# EAGLE design waterduck (EAGLE 6.5.0)
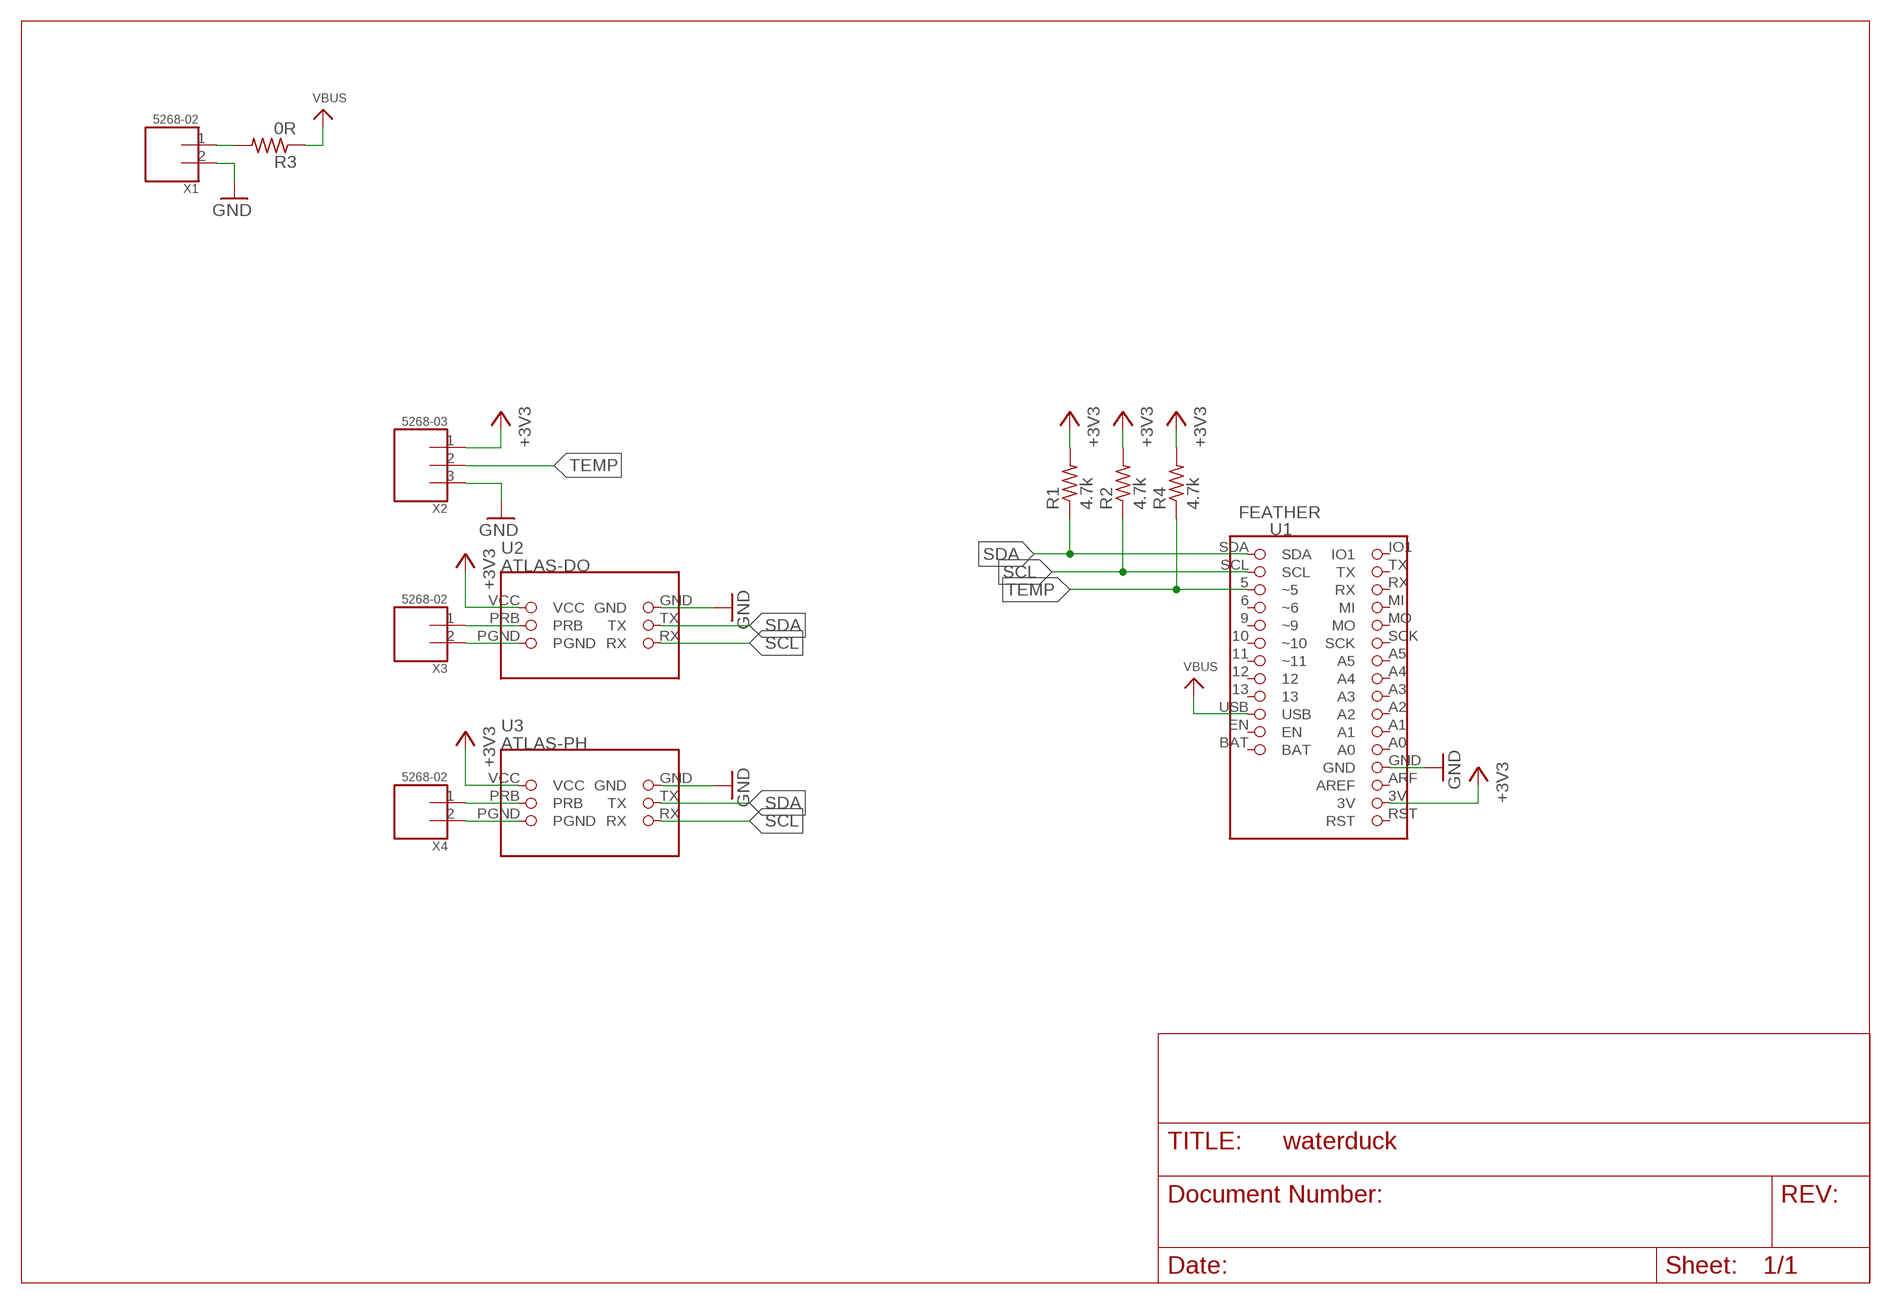
[diagram p0: schematic, sheet 1]

## Parts
R1  4.7k  R0603(1608)  [R0603(1608)]
R2  4.7k  R0603(1608)  [R0603(1608)]
R3  0R  R0603(1608)  [R0603(1608)]
R4  4.7k  R0603(1608)  [R0603(1608)]
U1  FEATHER  [FEATHER]
U2  ATLAS-DO  [ATLAS]
U3  ATLAS-PH  [ATLAS]
X1  5268-02  [5628-02]
X2  5268-03  [5268-03]
X3  5268-02  [5628-02]
X4  5268-02  [5628-02]

## Nets
+3V3: R1.2 R2.2 R4.2 U1.3V U2.VCC U3.VCC X2.1
GND: U1.GND U2.GND U3.GND X1.2 X2.3
N$1: U2.PRB X3.1
N$2: U2.PGND X3.2
N$3: U3.PRB X4.1
N$4: U3.PGND X4.2
N$5: R3.2 X1.1
SCL: R2.1 U1.SCL U2.RX U3.RX
SDA: R1.1 U1.SDA U2.TX U3.TX
TEMP: R4.1 U1.5(~5) X2.2
VBUS: R3.1 U1.USB
Unconnected: U1.6(~6) U1.9(~9) U1.10(~10) U1.11(~11) U1.12 U1.13 U1.A0 U1.A1 U1.A2 U1.A3 U1.A4 U1.A5 U1.ARF(AREF) U1.BAT U1.EN U1.IO1 U1.MI U1.MO U1.RST U1.RX U1.SCK U1.TX

## Library data of the parts
R1-R4 = waterduck:R
U1 = waterduck:FEATHER
U2 U3 = waterduck:ATLAS
X1 X3 X4 = waterduck:5268-02
X2 = waterduck:5268-03

## Board
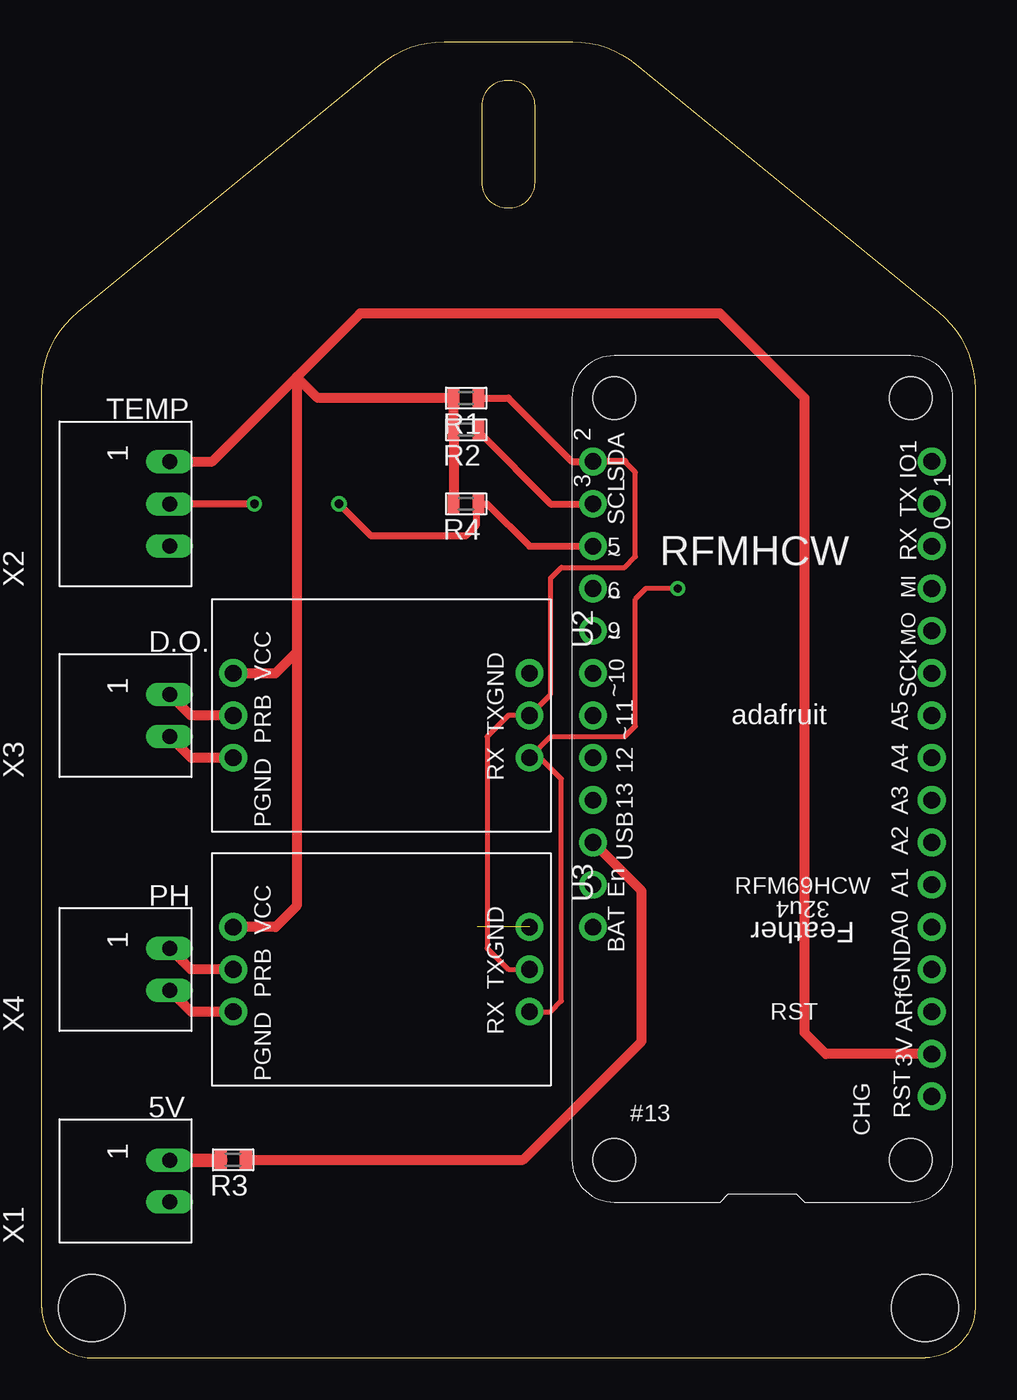
[diagram p1: board, top side]
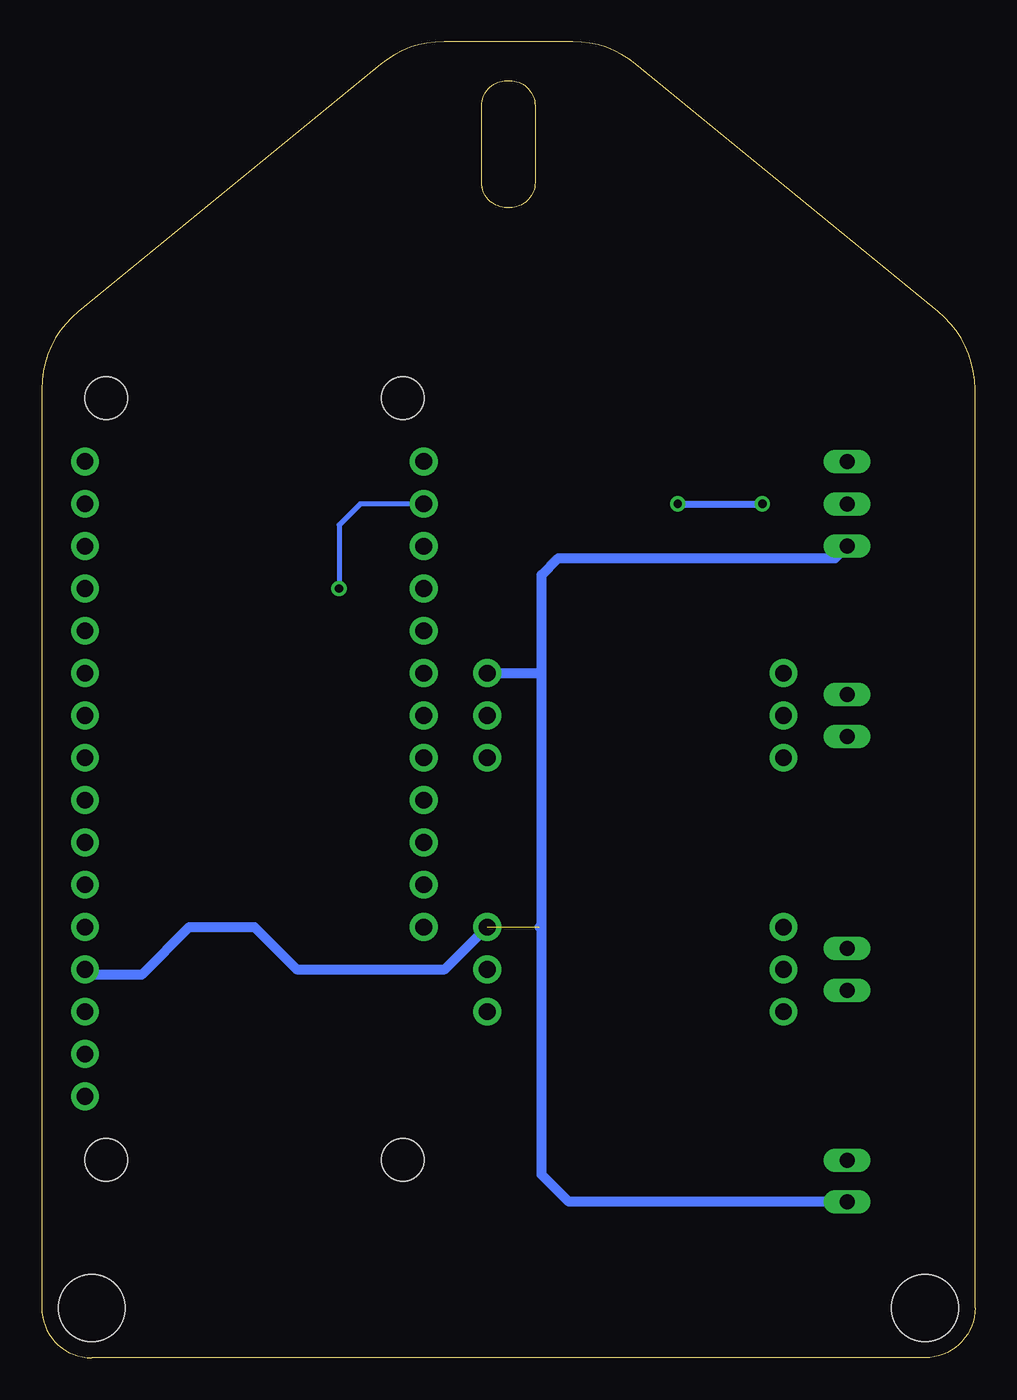
[diagram p2: board, bottom side, seen from below]

Size 56 x 79 mm. Coordinates in mm from the lower left corner, seen from the top.
Outline: 2.2,62.8 20.34,77.64 arc-39 24.14,79 31.86,79 arc-39 35.66,77.64 53.8,62.8 arc-51 56,58.16 56,3 arc-90 53,0 3,0 arc-90 0,3 0,58.16 arc-51 2.2,62.8
Outline: 26.4,75.16 26.4,70.54 arc90 27.9,69.04 28.1,69.04 arc90 29.6,70.54 29.6,75.16 arc90 28.1,76.66 27.9,76.66 arc90 26.4,75.16
Copper layers (1*16): Top 0.035mm / dielectric 1.5mm / Bottom 0.035mm
Design rules "default": minimum track width 10mil, minimum drill 24mil, track to track 8mil, track to pad 8mil, pad to pad 8mil, via to via 8mil, smd to smd 8mil, copper to edge 40mil, drill to drill 8mil, minimum pad ring 10mil, minimum via ring 8mil, stop-mask expansion 4mil, vias tented up to drill 0mil, thermal gap 10mil
Holes 4 mm at 3,3 53,3

### Footprints (pad centres in the part's own frame; a part is rotated, then mirrored left to right if it is on the bottom)
R0603(1608) = smd 0.7 x 1.1: 1 -0.75,0; 2 0.75,0
FEATHER = drill 1 pad 1.676: 3V 8.89,1.27; 5 39.37,21.59; 6 36.83,21.59; 9 34.29,21.59; 10 31.75,21.59; 11 29.21,21.59; 12 26.67,21.59; 13 24.13,21.59; A0 16.51,1.27; A1 19.05,1.27; A2 21.59,1.27; A3 24.13,1.27; A4 26.67,1.27; A5 29.21,1.27; ARF 11.43,1.27; BAT 16.51,21.59; EN 19.05,21.59; GND 13.97,1.27; IO1 44.45,1.27; MI 36.83,1.27; MO 34.29,1.27; RST 6.35,1.27; RX 39.37,1.27; SCK 31.75,1.27; SCL 41.91,21.59; SDA 44.45,21.59; TX 41.91,1.27; USB 21.59,21.59 | hole 2.54: 48.26,20.32; 48.26,2.54; 2.54,2.54; 2.54,20.32
ATLAS = drill 1 pad 1.676: GND -2.54,19.05; PGND 2.54,1.27; PRB 0,1.27; RX 2.54,19.05; TX 0,19.05; VCC -2.54,1.27
5628-02 = drill 0.9 long: 1 1.25,0; 2 -1.25,0
5268-03 = drill 0.9 long: 1 2.54,0; 2 0,0; 3 -2.54,0

### Placement (x,y rotation side)
R1  25.46,57.61 180 top
R2  25.46,55.7 180 top
R3  11.49,11.89 180 top
R4  25.46,51.26 180 top
U1  54.67,9.35 90 top
U2  10.22,38.56 270 top
U3  10.22,23.32 270 top
X1  7.68,10.62 90 top
X2  7.68,51.26 90 top
X3  7.68,38.56 90 top
X4  7.68,23.32 90 top

### Tracks (layer width: path | path; a pad name or v marks a point on that pad's centre or on a via)
+3V3
  Top 0.61: U1.3V 47.05,18.24 45.78,19.51 45.78,57.61 40.7,62.69 19.11,62.69 15.3,58.88 | 15.3,58.88 15.3,42.37 | 15.3,42.37 15.3,27.13 14.03,25.86 U3.VCC | U2.VCC 14.03,41.1 15.3,42.37 | X2.1 10.22,53.8 15.3,58.88 | R4.2 R2.2 R1.2 16.57,57.61 15.3,58.88
GND  (1 unrouted)
  Bottom 0.61: X1.2 24.37,9.37 26,11 26,26 | 26,26 26,41 | 26,41 26,47 25,48 8.4,48 X2.3 | U2.GND 26.1,41.1 26,41 | U1.GND 53.08,23 50,23 47.14,25.86 43.24,25.86 40.7,23.32 31.81,23.32 U3.GND | 26.14,25.86 26,26
N$1
  Top 0.61: U2.PRB 8.93,38.56 X3.1
N$2
  Top 0.61: U2.PGND 8.97,36.02 X3.2
N$3
  Top 0.61: U3.PRB 8.93,23.32 X4.1
N$4
  Top 0.61: U3.PGND 8.97,20.78 X4.2
N$5
  Top 0.813: X1.1 10.74,11.87 R3.2
SCL  (via drill 0.5)
  Top 0.305: U3.RX 30.54,20.78 31.18,21.41 31.18,34.75 29.91,36.02 | U2.RX 30.54,37.29 34.98,37.29 35.62,37.92 35.62,45.55 36.26,46.18 v38.16,46.18
  Top 0.406: R2.1 26.21,55.59 30.54,51.26 U1.SCL | 29.91,36.02 U2.RX
  Bottom 0.305: U1.SCL 36.89,51.26 38.16,49.99 v38.16,46.18
SDA
  Top 0.305: U3.TX 28,23.32 26.73,24.59 26.73,37.29 28,38.56 U2.TX 30.54,39.83 30.54,46.81 31.18,47.45 34.98,47.45 35.62,48.09 35.62,53.16 34.98,53.8
  Top 0.406: R1.1 28,57.61 31.81,53.8 U1.SDA 34.98,53.8
TEMP  (via drill 0.5)
  Top 0.406: U1.5 29.27,48.72 26.73,51.26 R4.1 26.09,51.15 26.09,49.99 25.46,49.35 19.74,49.35 v17.84,51.26 | v12.76,51.26 X2.2
  Bottom 0.406: v17.84,51.26 v12.76,51.26
VBUS
  Top 0.61: R3.1 28.89,11.89 36,19 36,28.02 U1.USB

### Text on the board
tPlace: TEMP | D.O. | PH | 5V